# EAGLE design power (EAGLE 7.1.0)
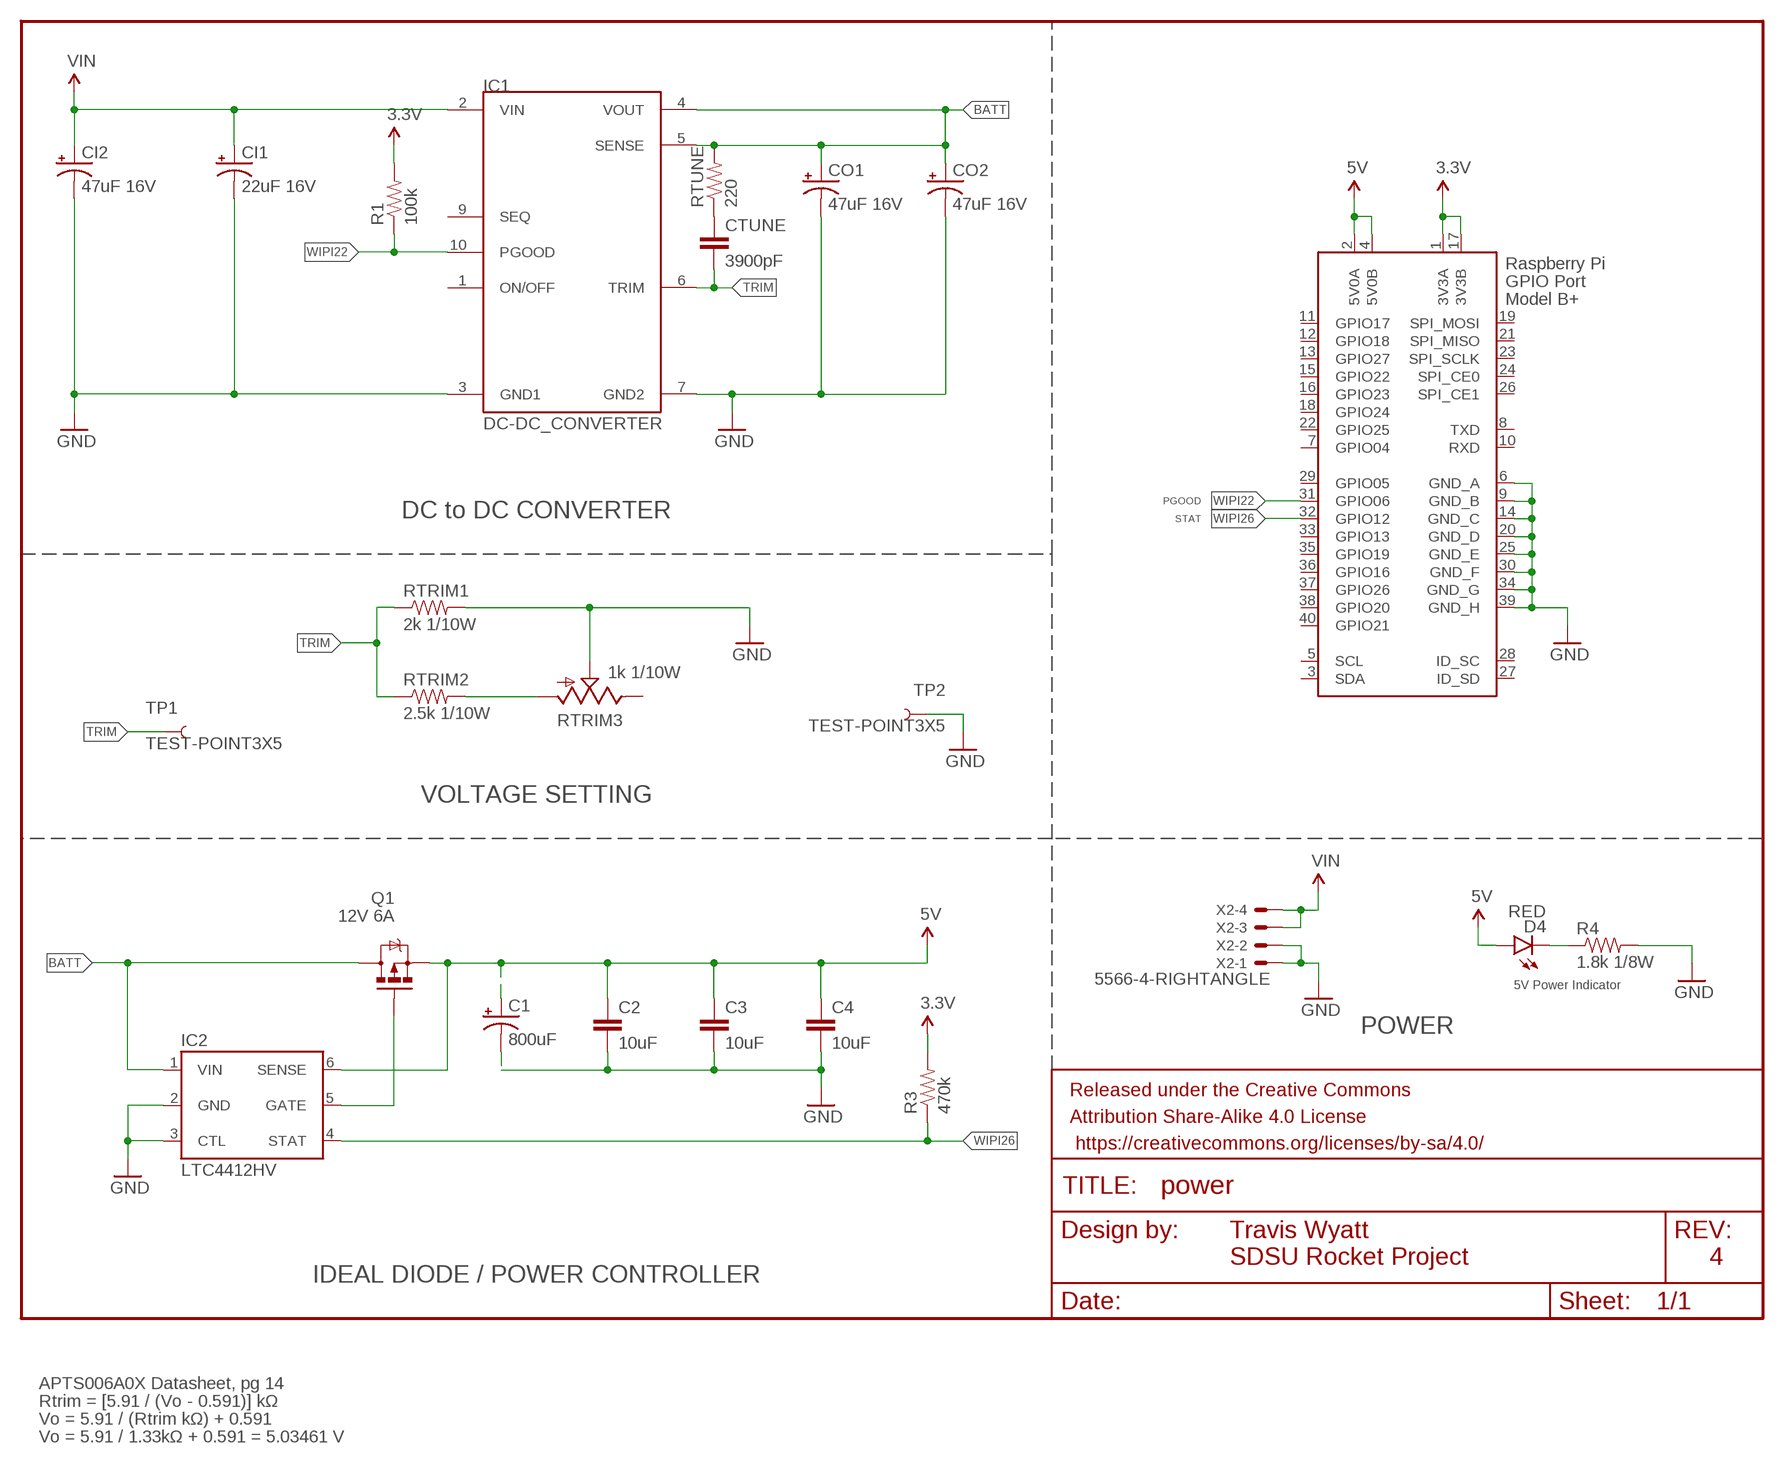
[diagram p0: schematic, sheet 1]

## Parts
C1  800uF  CAP_POLG  [PANASONIC_G]
C2  10uF  CAP0603-CAP  [0603-CAP]
C3  10uF  CAP0603-CAP  [0603-CAP]
C4  10uF  CAP0603-CAP  [0603-CAP]
CI1  22uF 16V  CAP_POLF80  [NIPPON_F80]
CI2  47uF 16V  CAP_POLF80  [NIPPON_F80]
CO1  47uF 16V  CAP_POLF80  [NIPPON_F80]
CO2  47uF 16V  CAP_POLF80  [NIPPON_F80]
CTUNE  3900pF  CAP0603-CAP  [0603-CAP]
D4  RED  LED0603  [LED-0603]
FRAME1  FRAME-LETTER  [CREATIVE_COMMONS]
IC1  DC-DC_CONVERTER  [DC-DC_CONVERTER]
IC2  LTC4412HV  LTC4412HV-SOT-23  [SOT23-6]
Q1  12V 6A  MOSFET-PCHANNEL-FDC606P  [SSOT-6L]
R1  100k  RESISTOR0603-RES  [0603-RES]
R3  470k  RESISTOR0603-RES  [0603-RES]
R4  1.8k 1/8W  RESISTOR0603-RES  [0603-RES]
RTRIM1  2k 1/10W  RESISTOR0603-RES  [0603-RES]
RTRIM2  2.5k 1/10W  RESISTOR0603-RES  [0603-RES]
RTRIM3  1k 1/10W  POT-89P  [89P]
RTUNE  220  RESISTOR0603-RES  [0603-RES]
TP1  TEST-POINT3X5  [PAD.03X.05]
TP2  TEST-POINT3X5  [PAD.03X.05]
X2  5566-4-RIGHTANGLE  [5566-4]
X3  RASPI_BOARD_B+#_H  [RASPI_BOARD_B+HAT]

## Nets
3.3V: R1.2 R3.2 X3.1(3V3A) X3.17(3V3B)
5V: C1.+ C2.1 C3.1 C4.1 D4.A IC2.6(SENSE) Q1.4(S) X3.2(5V0A) X3.4(5V0B)
BATT: CO1.+ CO2.+ IC1.4(VOUT) IC1.5(SENSE) IC2.1(VIN) Q1.1(D) Q1.2(D) Q1.5(D) Q1.6(D) RTUNE.2
GND: C1.- C2.2 C3.2 C4.2 CI1.- CI2.- CO1.- CO2.- IC1.3(GND1) IC1.7(GND2) IC2.2(GND) IC2.3(CTL) R4.2 RTRIM1.2 RTRIM3.2(S) TP2.P$1 X2.1 X2.2 X3.6(GND_A) X3.9(GND_B) X3.14(GND_C) X3.20(GND_D) X3.25(GND_E) X3.30(GND_F) X3.34(GND_G) X3.39(GND_H)
N$1: IC2.5(GATE) Q1.3(G)
N$2: CTUNE.1 RTUNE.1
N$3: RTRIM2.2 RTRIM3.1(A)
N$4: D4.C R4.1
TRIM: CTUNE.2 IC1.6(TRIM) RTRIM1.1 RTRIM2.1 TP1.P$1
VIN: CI1.+ CI2.+ IC1.2(VIN) X2.3 X2.4
WIPI22: IC1.10(PGOOD) R1.1 X3.31(GPIO06)
WIPI26: IC2.4(STAT) R3.1 X3.32(GPIO12)
Unconnected: IC1.1(ON/OFF) IC1.9(SEQ) RTRIM3.3(E) X3.3(SDA) X3.5(SCL) X3.7(GPIO04) X3.8(TXD) X3.10(RXD) X3.11(GPIO17) X3.12(GPIO18) X3.13(GPIO27) X3.15(GPIO22) X3.16(GPIO23) X3.18(GPIO24) X3.19(SPI_MOSI) X3.21(SPI_MISO) X3.22(GPIO25) X3.23(SPI_SCLK) X3.24(SPI_CE0) X3.26(SPI_CE1) X3.27(ID_SD) X3.28(ID_SC) X3.29(GPIO05) X3.33(GPIO13) X3.35(GPIO19) X3.36(GPIO16) X3.37(GPIO26) X3.38(GPIO20) X3.40(GPIO21)

## Notes on the sheet
- PGOOD
- DC to DC CONVERTER | STAT
- VOLTAGE SETTING
- 5V Power Indicator
- POWER
- Travis Wyatt
- SDSU Rocket Project
- 4
- IDEAL DIODE / POWER CONTROLLER
- APTS006A0X Datasheet, pg 14
- Rtrim = [5.91 / (Vo - 0.591)] kΩ
- Vo = 5.91 / (Rtrim kΩ) + 0.591
- Vo = 5.91 / 1.33kΩ + 0.591 = 5.03461 V

## Library data of the parts
C1 CI1 CI2 CO1 CO2 = SparkFun-Capacitors:CAP_POL: Capacitor Polarized These are standard SMD and PTH capacitors. Normally 10uF, 47uF, and 100uF in electrolytic and tantalum varieties. Always verify the external diameter of the through hole cap, it varies with capacity, voltage, and manufacturer. The EIA devices should be standard.
C2-C4 CTUNE = SparkFun-Capacitors:CAP: Capacitor Standard 0603 ceramic capacitor, and 0.1" leaded capacitor.
D4 = SparkFun-LED:LED: LEDs Standard schematic elements and footprints for 5mm, 3mm, 1206, and 0603 sized LEDs. 5mm - Spark Fun Electronics SKU : COM-00529 (and others)
FRAME1 = SparkFun-Aesthetics:FRAME-LETTER: Schematic Frame Standard 8.5x11 US Letter frame; DESIGNER: NAME; VERSION: v01
IC1 = SparkFun-PowerIC:DC-DC_CONVERTER: APTS006A0X-SRZ Step-down 6A variable voltage switching module (TOL-09275)
IC2 = SDSURocket-PowerIC:LTC4412: Linear Technology Low Loss PowerPath™, SOT23-6; PROD_ID: LTC4412HVIS6
Q1 = SDSURocket-PowerIC:MOSFET-PCHANNEL; PROD_ID: FDC606PCT-ND; VALUE: 12V/6A
R1 R4 RTRIM1 RTRIM2 = SparkFun-Resistors:RESISTOR: Resistor Basic schematic elements and footprints for 0603, 1206, and PTH resistors.
R3 RTUNE = SparkFun-Passives:RESISTOR: Resistor Basic schematic elements and footprints for 0603, 1206, and PTH resistors.
RTRIM3 = SDSURocket-Electromechanical:POT-89P
TP1 TP2 = SparkFun-Passives:TEST-POINT: Bare copper test points for troubleshooting or ICT
X2 = SDSURocket-Connectors:5566-4: Mini FIT connector 4 pol Source: http://www.molex.com; OC_FARNELL: unknown; OC_NEWARK: unknown
X3 = raspberrypi_bastelstube_v13:RASPI_BOARD_B+#: Raspberry Pi GPIO connector with markings for the outer dimensions of the Raspberry Pi board model B+ with different sets of drill holes or mounting pads All pins connected

## Board
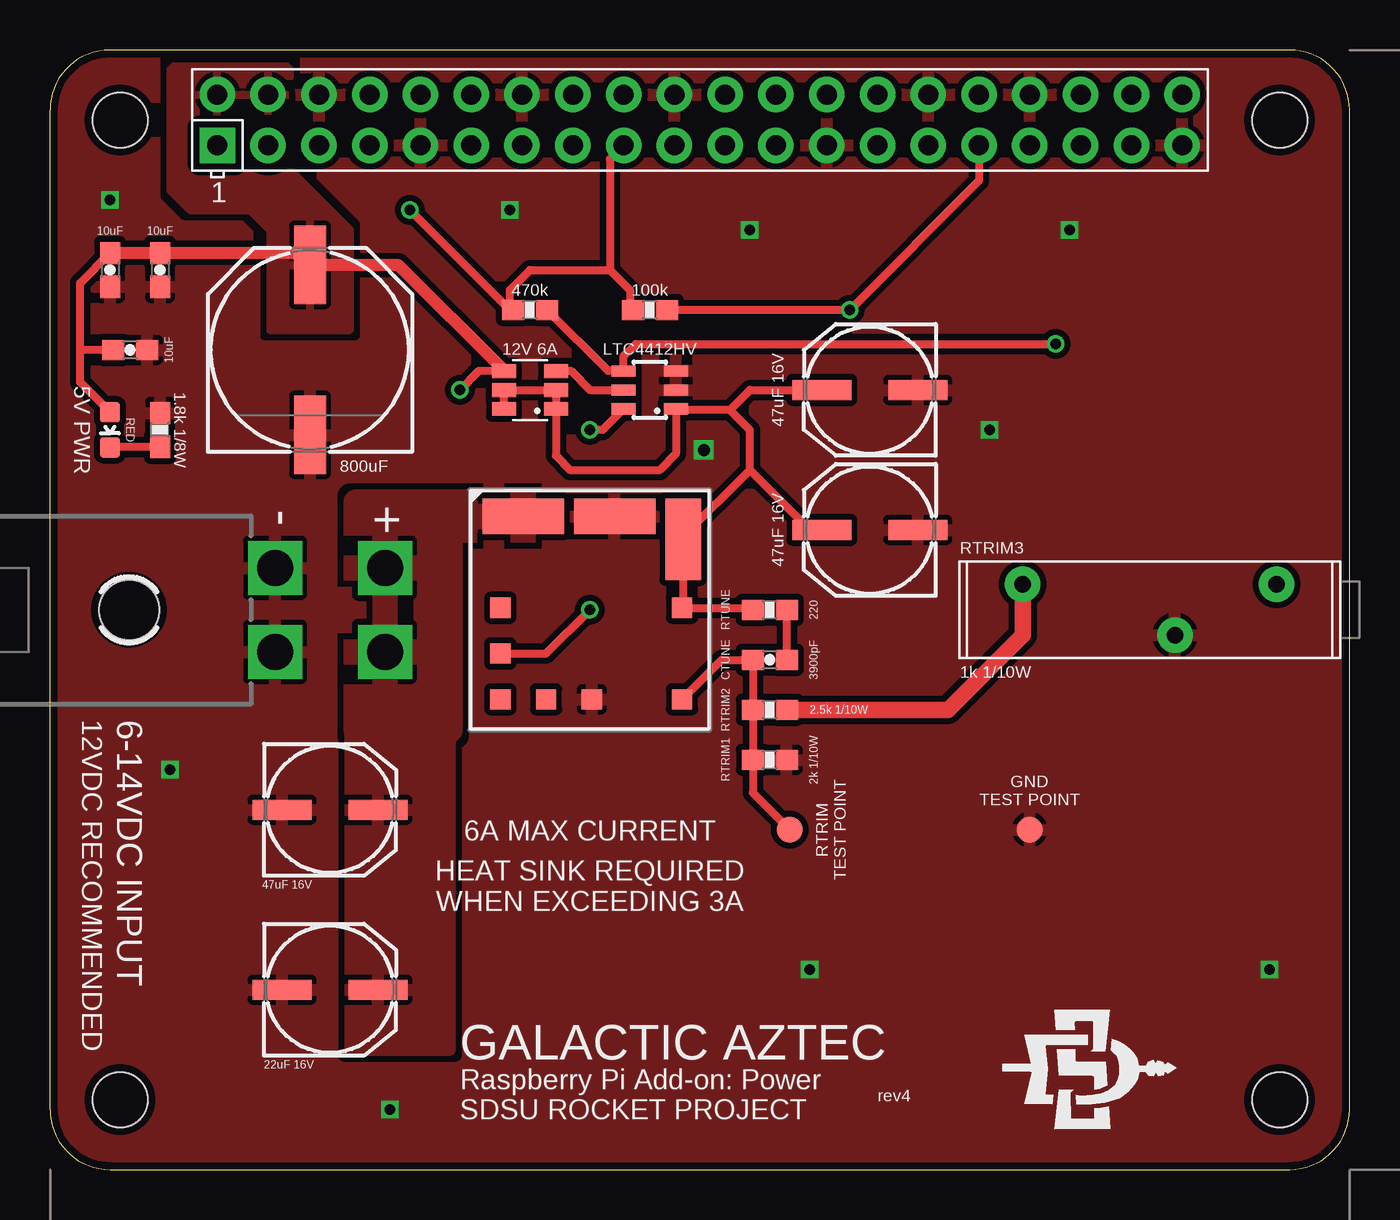
[diagram p1: board, top side]
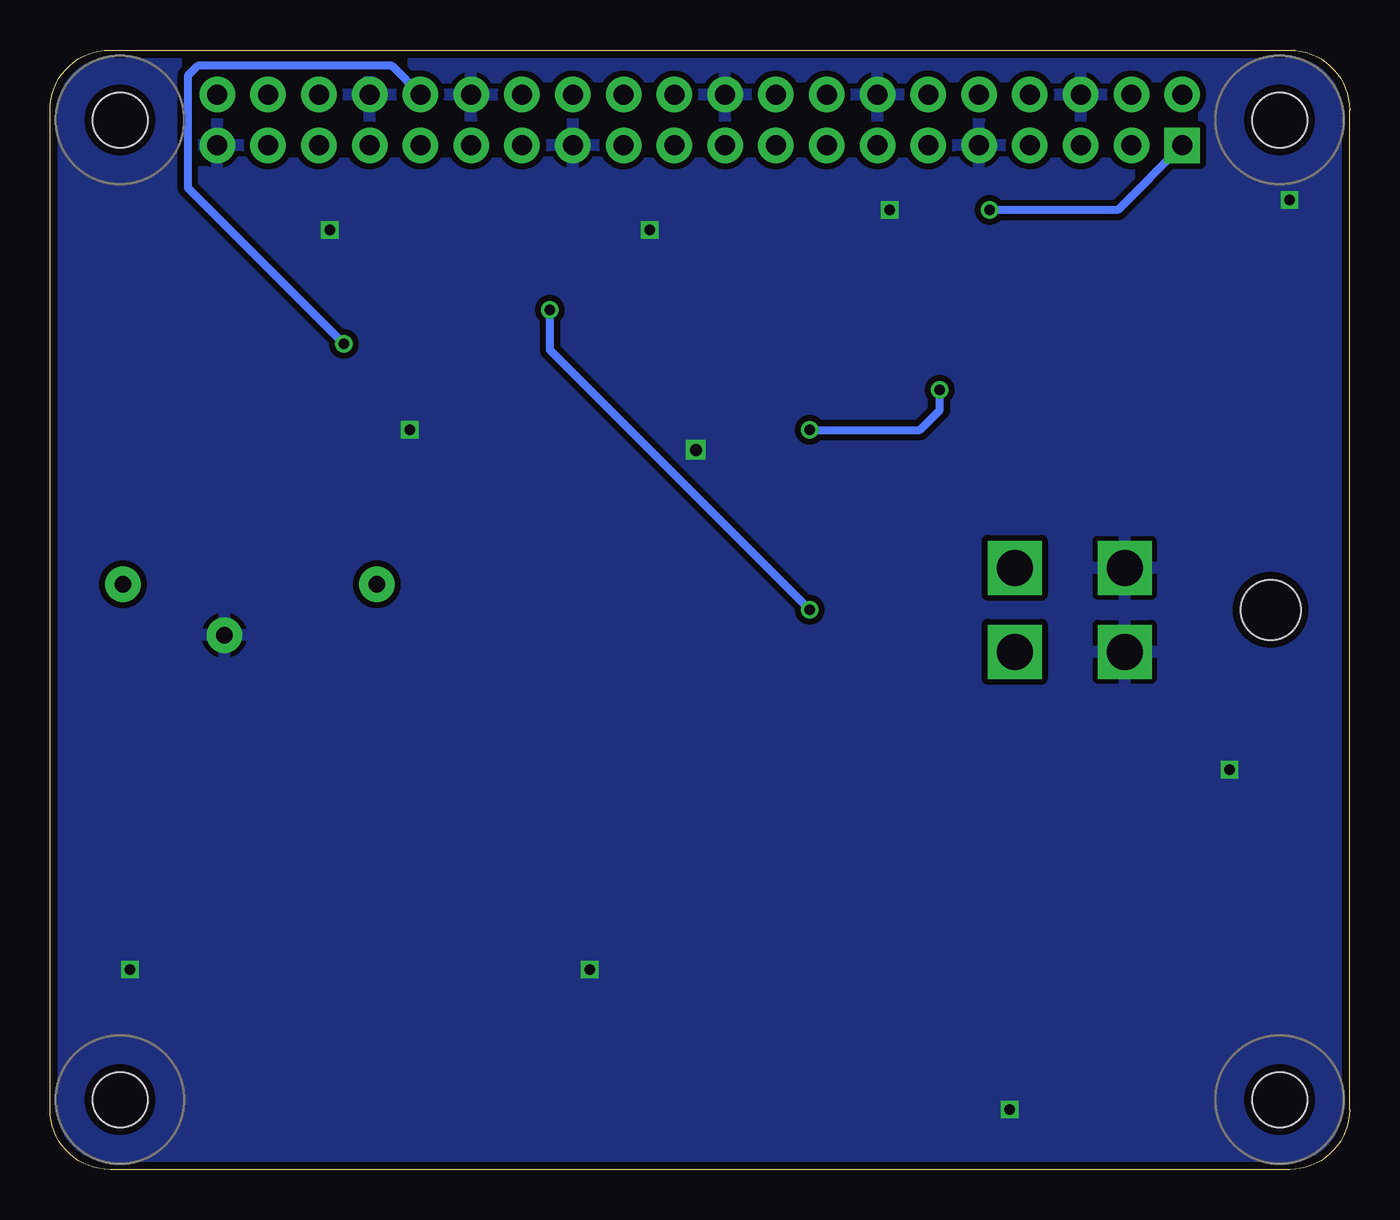
[diagram p2: board, bottom side, seen from below]

Size 65 x 56 mm. Coordinates in mm from the lower left corner, seen from the top.
Copper layers (1*16): Top 0.0356mm / dielectric 1.5011mm / Bottom 0.0356mm
Design rules "SparkFunBestPractices": minimum track width 10mil, minimum drill 13mil, track to track 10mil, track to pad 10mil, pad to pad 10mil, via to via 10mil, smd to smd 10mil, copper to edge 15mil, drill to drill 12mil, minimum pad ring 7mil, minimum via ring 7mil, stop-mask expansion 3mil, vias tented up to drill 0mil, thermal gap 10mil

### Footprints (pad centres in the part's own frame; a part is rotated, then mirrored left to right if it is on the bottom)
PANASONIC_G = smd 3.9 x 1.6: + 4.25,0; - -4.25,0
0603-CAP = smd 1.1 x 1: 1 -0.85,0; 2 0.85,0
NIPPON_F80 = smd 2.95 x 1: + 2.4,0; - -2.4,0
LED-0603 = smd 1 x 1: A 0,-0.877; C 0,0.877
DC-DC_CONVERTER = smd 1.01 x 1.01: 1 -4.48,0.1; 5 4.61,0.1; 6 4.61,-4.48; 7 0.1,-4.48; 8 -2.19,-4.48; 9 -4.48,-4.48; 10 -4.48,-2.19 | smd 4.07 x 1.77: 2 -3.33,4.67; 3 1.24,4.67 | smd 1.77 x 4.07: 4 4.67,3.53
SOT23-6 = smd 0.55 x 1.2: 1 0.95,1.3; 2 0,1.3; 3 -0.95,1.3; 4 -0.95,-1.3; 5 0,-1.3; 6 0.95,-1.3
SSOT-6L = smd 0.7 x 1.2: 1 0.95,1.3; 2 0,1.3; 3 -0.95,1.3; 4 -0.95,-1.3; 5 0,-1.3; 6 0.95,-1.3
0603-RES = smd 1.1 x 1: 1 -0.85,0; 2 0.85,0
89P = drill 0.813 pad 1.778: 1 -6.35,1.27; 2 1.27,-1.27; 3 6.35,1.27
PAD.03X.05 = smd 1.27 x 1.27: P$1 0,0
5566-4 = drill 1.8 square: 1 2.1,-2.75; 2 -2.1,-2.75; 3 2.1,2.75; 4 -2.1,2.75 | hole 3: 0,-10.05
RASPI_BOARD_B+HAT = drill 1 pad 1.778 square: 1 8.37,51.23 | drill 1 pad 1.778: 2 8.37,53.77; 3 10.91,51.23; 4 10.91,53.77; 5 13.45,51.23; 6 13.45,53.77; 7 15.99,51.23; 8 15.99,53.77; 9 18.53,51.23; 10 18.53,53.77; 11 21.07,51.23; 12 21.07,53.77; 13 23.61,51.23; 14 23.61,53.77; 15 26.15,51.23; 16 26.15,53.77; 17 28.69,51.23; 18 28.69,53.77; 19 31.23,51.23; 20 31.23,53.77; 21 33.77,51.23; 22 33.77,53.77; 23 36.31,51.23; 24 36.31,53.77; 25 38.85,51.23; 26 38.85,53.77; 27 41.39,51.23; 28 41.39,53.77; 29 43.93,51.23; 30 43.93,53.77; 31 46.47,51.23; 32 46.47,53.77; 33 49.01,51.23; 34 49.01,53.77; 35 51.55,51.23; 36 51.55,53.77; 37 54.09,51.23; 38 54.09,53.77; 39 56.63,51.23; 40 56.63,53.77 | hole 2.75: 3.5,3.5; 3.5,52.5; 61.5,3.5; 61.5,52.5

### Placement (x,y rotation side)
C1  13,41 90 top
C2  5.5,45 270 top
C3  3,45 270 top
C4  4,41 0 top
CI1  14,9 0 top
CI2  14,18 0 top
CO1  41,39 180 top
CO2  41,32 180 top
CTUNE  36,25.5 180 top
D4  3,37 180 top
FRAME1  0,-18 0 top  (outside the outline)
IC1  27,28 0 top
IC2  30,39 270 top
Q1  24,39 270 top
R1  30,43 180 top
R3  24,43 180 top
R4  5.5,37 90 top
RTRIM1  36,20.5 0 top
RTRIM2  36,23 0 top
RTRIM3  55,28 0 top
RTUNE  36,28 180 top
TP1  37,17 0 top
TP2  49,17 0 top
X2  14,28 270 top
X3  0,0 0 top

### Tracks (layer width: path | path; a pad name or v marks a point on that pad's centre or on a via)
3.3V  (via drill 0.51)
  Top 0.406: v18,48 23,43 | 23,43.15 23,44 24,45 28,45 | 28,45 29,44 29,43.15 | X3.17 28,50.54 28,45
  Top 0.61: 23,43 R3.2 23,43.15 | 29,43.15 R1.2
  Bottom 0.406: X3.1 11.6,48 v18,48
5V  (via drill 0.51)
  Top 0.406: D4.A 1.5,39.38 1.5,41 | 1.5,41 1.5,44.35 C3.1 | IC2.6 27.65,37 v27,37 | v20.5,39 21.45,39.95 Q1.4 | C4.1 1.5,41
  Top 0.61: C3.1 C2.1 12.4,45.85 | Q1.4 17.4,45.25 C1.+
  Top 0.813: 12.4,45.85 C1.+
  Bottom 0.406: v27,37 21.5,37 20.5,38 v20.5,39
  pour Top (isolate 0.61): 11,56 7,56 6,55 6,49 7,48 10,48 11,47 11,42 15,42 15,47 12,50 12,55
BATT
  Top 0.406: Q1.6 Q1.5 Q1.2 Q1.1 25.3,35.7 26,35 30.5,35 31.3,35.8 IC2.1 31.35,38 34,38 | RTUNE.2 35.05,28.1 IC1.5 31.67,28.16 IC1.4 31.67,31.67 35,35 | CO2.+ 38,32 35,35 | CO1.+ 35,39 34,38 | 35,35 35,37 34,38
GND  (via drill 0.51, 0.6)
  other vias: 6,20 38,10 61,10 47,37 35,47 51,47 23,48 3,48.5 32.7,36 17,3
  pour Top (isolate 0.305, rank 6): 0,0 0,56 65,56 65,0
  pour Bottom (isolate 0.305): 0,0 0,56 65,56 65,0
N$1
  Top 0.406: Q1.3 26.05,39.95 27,39 IC2.5
N$2
  Top 0.406: CTUNE.1 RTUNE.1
N$3
  Top 0.813: RTRIM2.2 44.92,23 48.65,26.73 RTRIM3.1
N$4
  Top 0.406: R4.1 3.03,36.15
  Top 0.61: 3.03,36.15 D4.C
TRIM
  Top 0.406: IC1.6 33.59,25.5 CTUNE.2 RTRIM2.1 RTRIM1.1 35.15,18.85 TP1.P$1
VIN
  pour Top (isolate 1.27): 15.3,22 20,22 20,32 25,32 25,33.4 15.3,33.4
  pour Top (isolate 1.27): 20,22 15,22 15,6 20,6
WIPI22  (via drill 0.51)
  Top 0.406: X3.31 46.47,49.47 v40,43 R1.1 | IC1.10 24.81,25.81 v27,28
  Bottom 0.406: v27,28 40,41 v40,43
WIPI26  (via drill 0.51)
  Top 0.406: R3.1 27.9,39.95 IC2.4 28.7,40.7 29.3,41.3 v50.3,41.3
  Bottom 0.406: X3.32 47.9,55.2 57.6,55.2 58.1,54.7 58.1,49.1 v50.3,41.3

### Text on the board
tNames: 5V PWR | - | + | 12VDC RECOMMENDED | 6-14VDC INPUT | GND / TEST POINT | 6A MAX CURRENT | RTRIM / TEST POINT | HEAT SINK REQUIRED / WHEN EXCEEDING 3A | GALACTIC AZTEC | Raspberry Pi Add-on: Power | rev4 | SDSU ROCKET PROJECT